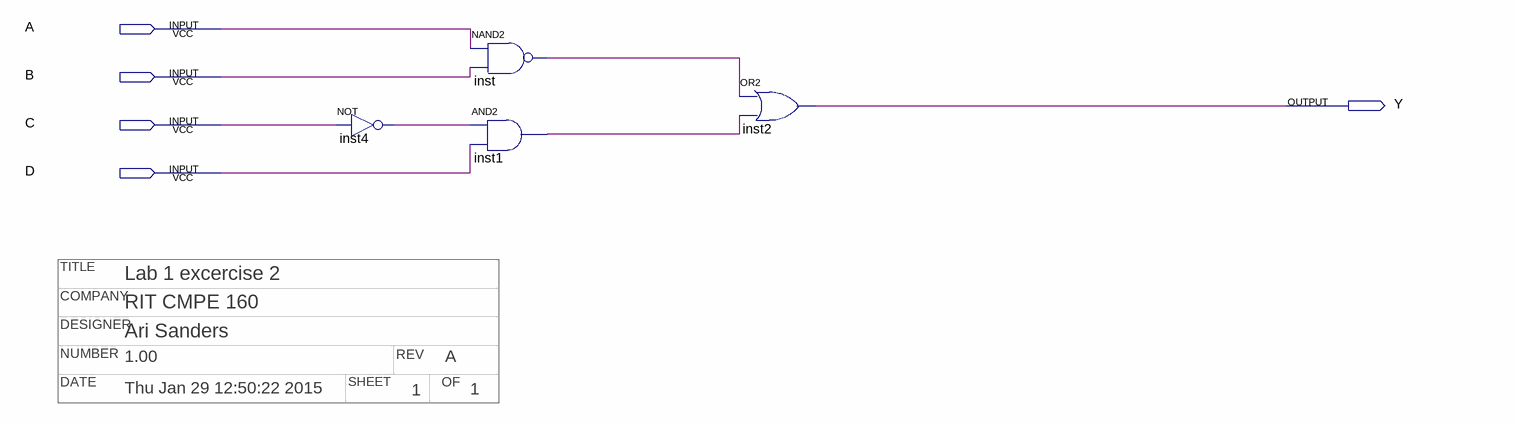
[diagram p0: schematic sheet]
// Quartus schematic Lab1ex2.bdf as structural Verilog: 4 symbols, 5 pins
// Title block: COMPANY: RIT CMPE 160; DATE: Thu Jan 29 12:50:22 2015; DESIGNER: Ari Sanders; NUMBER: 1.00; OF: 1; REV: A; SHEET: 1; TITLE: Lab 1 excercise 2
module Lab1ex2 (
  input  A,
  input  B,
  input  C,
  input  D,
  output Y
);

  wire inst1_out, inst4_out, inst_out;

  not inst4 (inst4_out, C);
  nand inst (inst_out, A, B);
  and inst1 (inst1_out, inst4_out, D);
  or inst2 (Y, inst_out, inst1_out);
endmodule
